# EAGLE schematic Works_000 (EAGLE 8.2.1)
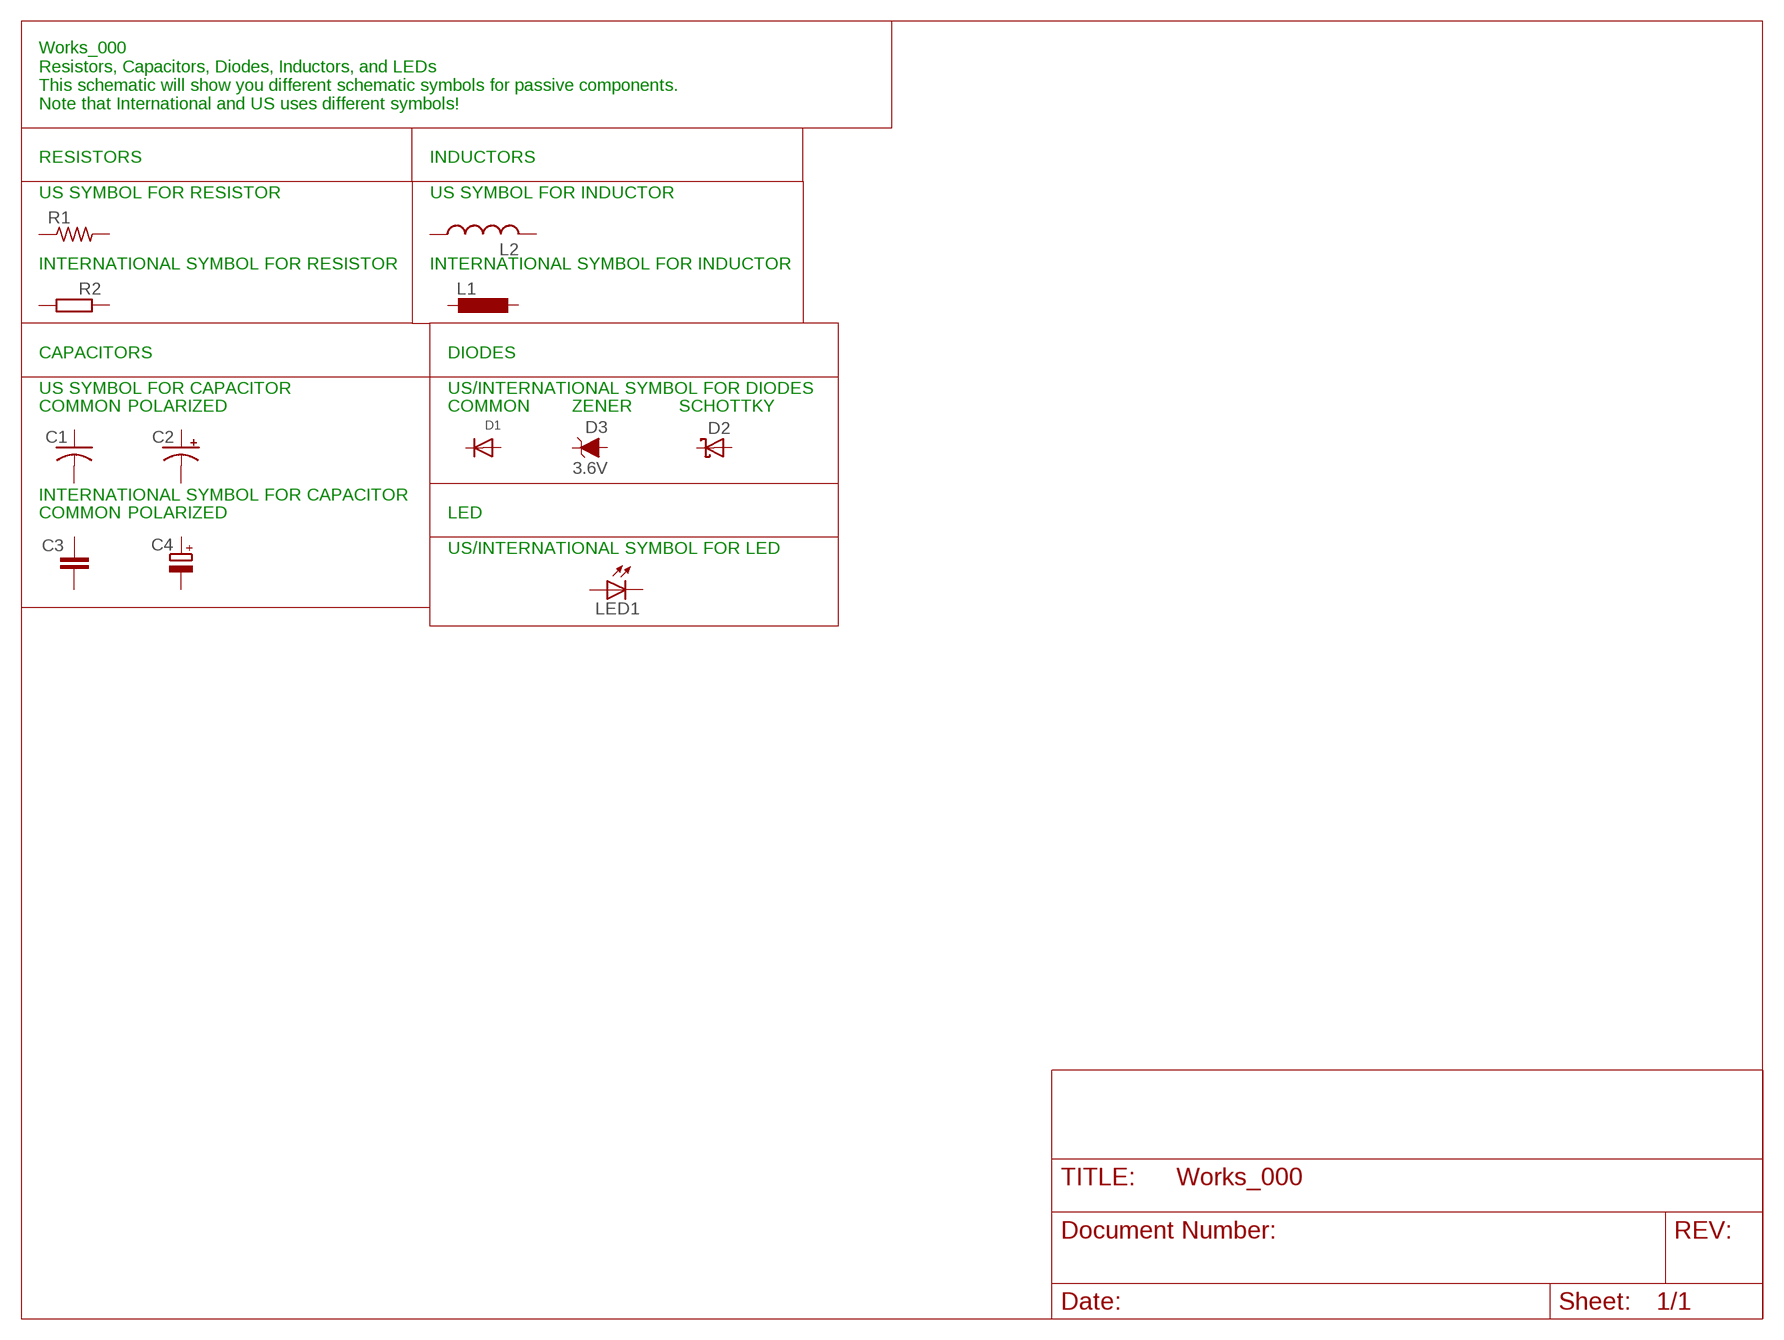
[diagram p0: schematic, sheet 1]

## Parts
C1  C-USC0805  [C0805]
C2  CPOL-USD  [PANASONIC_D]
C3  C-EUC0805  [C0805]
C4  CPOL-EUD  [PANASONIC_D]
D1  DIODESOT23_REFLOW  [SOT23-R]
D2  SCHOTTKY-DIODEAG  [AG]
D3  3.6V  DIODE-ZENER-BZT52C3V6S  [SOD-323]
L1  L-EUL5650M  [L5650M]
L2  L-USTJ3-U1  [TJ3-U1]
LED1  LED5MM  [LED5MM]
R1  R-US_R0805  [R0805]
R2  R-EU_R0805  [R0805]
Unconnected: C1.1 C1.2 C2.+ C2.- C3.1 C3.2 C4.+ C4.- D1.1(A) D1.3(C) D2.A D2.C D3.A D3.C L1.1 L1.2 L2.1 L2.2 LED1.A LED1.K(C) R1.1 R1.2 R2.1 R2.2

## Notes on the sheet
- Works_000
  Resistors, Capacitors, Diodes, Inductors, and LEDs
  This schematic will show you different schematic symbols for passive components.
  Note that International and US uses different symbols!
- RESISTORS | INDUCTORS
- US SYMBOL FOR RESISTOR | US SYMBOL FOR INDUCTOR
- INTERNATIONAL SYMBOL FOR RESISTOR | INTERNATIONAL SYMBOL FOR INDUCTOR
- CAPACITORS | DIODES
- US SYMBOL FOR CAPACITOR | US/INTERNATIONAL SYMBOL FOR DIODES
- COMMON | POLARIZED | COMMON | ZENER | SCHOTTKY
- INTERNATIONAL SYMBOL FOR CAPACITOR
- COMMON | POLARIZED | LED
- US/INTERNATIONAL SYMBOL FOR LED

## Library data of the parts
C1 = adafruit:C-US: CAPACITOR, American symbol
C2 = adafruit:CPOL-US: POLARIZED CAPACITOR, American symbol
C3 = rcl:C-EU: CAPACITOR, European symbol
C4 = rcl:CPOL-EU: POLARIZED CAPACITOR, European symbol
D1 = adafruit:DIODE: Diode SMADIODE - SMA Surface Mount Package 20V 1A Schottky Diode Digikey: 641-1014-6-ND DO-1N4148 - Through Hole Small Current Diode SOD-123 20V 1 A (.5mV Vf) Schottky Diode - Digikey: MBRX120TPMSCT-ND SOD-323 10V 570mA (.38mV Vf, 3ns) Schottky Diode - Digikey: ZLLS410CT-ND SOD-523 30V 30mA Schottky Diode (RB751S-40TE61) - Digikey: RB751S-40TE61CT-ND SOT23-R/W - SOT23 Package (R = Solder Paste/Reflow Ovens, W = Hand-Soldering) BAT54Film 40V 300mA - Digikey: 497-7162-1-ND
D2 = adafruit:SCHOTTKY-DIODE: Schottky Diode
D3 = SparkFun-DiscreteSemi:DIODE-ZENER: Zener Diode A Zener diode allows current to flow from its anode to its cathode like a normal semiconductor diode, but it also permits current to flow in the reverse direction when its "Zener voltage" is reached. - WIkipedia; PROD_ID: DIO-08199
L1 = resistor:L-EU: INDUCTOR, European symbol
L2 = resistor:L-US: INDUCTOR, American symbol
LED1 = adafruit:LED: LED OSRAM: - CHIPLED LG R971, LG N971, LY N971, LG Q971, LY Q971, LO R971, LY R971 LH N974, LH R974 LS Q976, LO Q976, LY Q976 LO Q996 - Hyper CHIPLED LW Q18S LB Q993, LB Q99A, LB R99A - SideLED LS A670, LO A670, LY A670, LG A670, LP A670 LB A673, LV A673, LT A673, LW A673 LH A674 LY A675 LS A676, LA A676, LO A676, LY A676, LW A676 LS A679, LY A679, LG A679 - Hyper Micro SIDELED® LS Y876, LA Y876, LO Y876, LY Y876 LT Y87S - SmartLED LW L88C, LW L88S LB L89C, LB L89S, LG L890 LS L89K, LO L89K, LY L89K LS L896, LA L896, LO L896, LY L896 - TOPLED LS T670, LO T670, LY T670, LG T670, LP T670 LSG T670, LSP T670, LSY T670, LOP T670, LYG T670 LG T671, LOG T671, LSG T671 LB T673, LV T673, LT T673, LW T673 LH T674 LS T676, LA T676, LO T676, LY T676, LB T676, LH T676, LSB T676, LW T676 LB T67C, LV T67C, LT T67C, LS T67K, LO T67K, LY T67K, LW E67C LS E67B, LA E67B, LO E67B, LY E67B, LB E67C, LV E67C, LT E67C LW T67C LS T679, LY T679, LG T679 LS T770, LO T770, LY T770, LG T770, LP T770 LB T773, LV T773, LT T773, LW T773 LH T774 LS E675, LA E675, LY E675, LS T675 LS T776, LA T776, LO T776, LY T776, LB T776 LHGB T686 LT T68C, LB T68C - Hyper Mini TOPLED® LB M676 - Mini TOPLED Santana® LG M470 LS M47K, LO M47K, LY M47K Source: http://www.osram.convergy.de/
R1 = adafruit:R-US_: RESISTOR, American symbol
R2 = rcl:R-EU_: RESISTOR, European symbol